# EAGLE design RPI-CM4-Breakout (EAGLE 9.6.2)
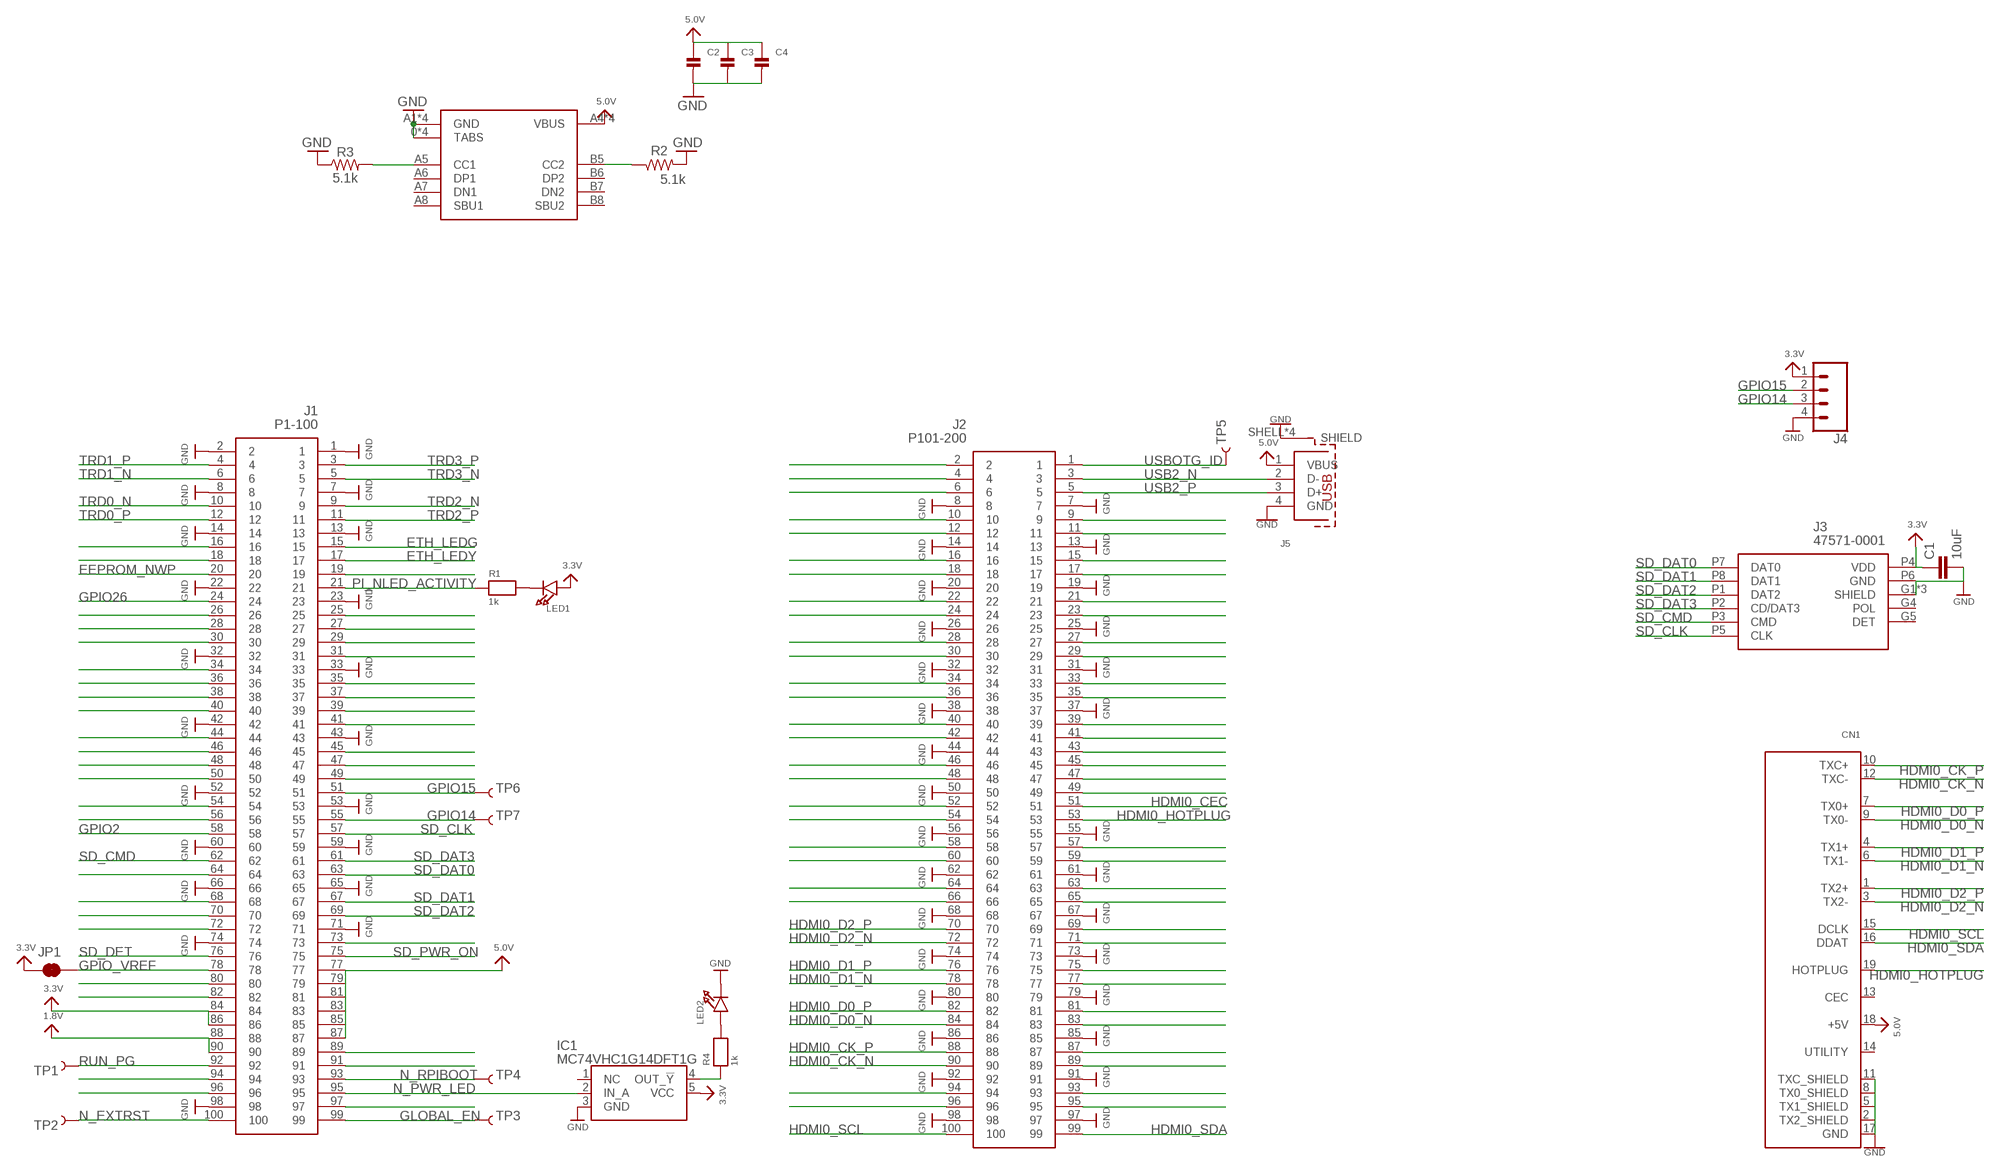
[diagram p0: schematic, sheet 1]

## Parts
C1  10uF  10UF-0603-6.3V-20%  [0603]
C2  CAP_CERAMIC0402  [0402]
C3  CAP_CERAMIC0402  [0402]
C4  CAP_CERAMIC0402  [0402]
CN1  HDMI_MOLEX_47151-0001  [HDMI_MOLEX_47151-0001]
IC1  MC74VHC1G14DFT1G  [SOT65P210X110-5N]
J1  P1-100  DF40C-100DS-0.4V_51_  [DF40C100DS04V51]
J2  P101-200  DF40C-100DS-0.4V_51_  [DF40C100DS04V51]
J3  47571-0001  [47571-0001]
J4  CONN_04SMD_RA_FEMALE  [1X04_SMD_RA_FEMALE]
J5  629104190121  [629104190121]
JP1  JUMPER-SMT_2_NC_TRACE_NO-SILK  [SMT-JUMPER_2_NC_TRACE_NO-SILK]
LED1  LED0603  [CHIPLED_0603]
LED2  LED0603  [CHIPLED_0603]
R1  1k  RESISTOR_0402MP  [_0402MP]
R2  5.1k  RESISTOR0603  [0603]
R3  5.1k  RESISTOR0603  [0603]
R4  1k  RESISTOR_0402MP  [_0402MP]
TP1  TEST-POINT3X5  [PAD.03X.05]
TP2  TEST-POINT3X5  [PAD.03X.05]
TP3  TEST-POINT3X5  [PAD.03X.05]
TP4  TEST-POINT3X5  [PAD.03X.05]
TP5  TEST-POINT3X5  [PAD.03X.05]
TP6  TEST-POINT3X5  [PAD.03X.05]
TP7  TEST-POINT3X5  [PAD.03X.05]
U$59  TYPE-C-31-M-12  [USB-TYPE-C_16PIN-MALE-TYPE-C-31-M-12]

## Nets
1.8V: J1.88 J1.90
3.3V: C1.1 IC1.5(VCC) J1.84 J1.86 J3.P4(VDD) J4.1 JP1.1 LED1.A
5.0V: C2.1 C3.1 C4.1 CN1.18(+5V) J1.77 J1.79 J1.81 J1.83 J1.85 J1.87 J5.1(VBUS) U$59.A4(VBUS) U$59.A9(VBUS) U$59.B4(VBUS) U$59.B9(VBUS)
A0/CC2: R3.2 U$59.A5(CC1)
A3/CC1: R2.1 U$59.B5(CC2)
EEPROM_NWP: J1.20
ETH_LEDG: J1.15
ETH_LEDY: J1.17
GLOBAL_EN: J1.99 TP3.P$1
GND: C1.2 C2.2 C3.2 C4.2 CN1.2(TX2_SHIELD) CN1.5(TX1_SHIELD) CN1.8(TX0_SHIELD) CN1.11(TXC_SHIELD) CN1.17(GND) IC1.3(GND) J1.1 J1.2 J1.7 J1.8 J1.13 J1.14 J1.22 J1.23 J1.32 J1.33 J1.42 J1.43 J1.52 J1.53 J1.59 J1.60 J1.65 J1.66 J1.71 J1.74 J1.98 J2.7 J2.8 J2.13 J2.14 J2.19 J2.20 J2.25 J2.26 J2.31 J2.32 J2.37 J2.38 J2.44 J2.50 J2.55 J2.56 J2.61 J2.62 J2.67 J2.68 J2.73 J2.74 J2.79 J2.80 J2.85 J2.86 J2.91 J2.92 J2.97 J2.98 J3.G1(SHIELD) J3.G2(SHIELD) J3.G3(SHIELD) J3.P6(GND) J4.4 J5.4(GND) J5.SHELL1(SHIELD) J5.SHELL2(SHIELD) J5.SHELL3(SHIELD) J5.SHELL(SHIELD) LED2.C R2.2 R3.1 U$59.0(TABS) U$59.0-1(TABS) U$59.0-2(TABS) U$59.0-3(TABS) U$59.A1(GND) U$59.A12(GND) U$59.B1(GND) U$59.B12(GND)
GPIO2: J1.58
GPIO14: J1.55 J4.3 TP7.P$1
GPIO15: J1.51 J4.2 TP6.P$1
GPIO26: J1.24
GPIO_VREF: J1.78 JP1.2
HDMI0_CEC: J2.51
HDMI0_CK_N: CN1.12(TXC-) J2.90
HDMI0_CK_P: CN1.10(TXC+) J2.88
HDMI0_D0_N: CN1.9(TX0-) J2.84
HDMI0_D0_P: CN1.7(TX0+) J2.82
HDMI0_D1_N: CN1.6(TX1-) J2.78
HDMI0_D1_P: CN1.4(TX1+) J2.76
HDMI0_D2_N: CN1.3(TX2-) J2.72
HDMI0_D2_P: CN1.1(TX2+) J2.70
HDMI0_HOTPLUG: CN1.19(HOTPLUG) J2.53
HDMI0_SCL: CN1.15(DCLK) J2.100
HDMI0_SDA: CN1.16(DDAT) J2.99
N$1: LED1.C R1.2
N$3: J2.2
N$4: IC1.4(OUT_!Y) R4.1
N$5: J2.4
N$6: LED2.A R4.2
N$7: J2.6
N$10: J2.9
N$11: J2.10
N$12: J2.11
N$13: J2.12
N$16: J1.16
N$17: J2.15
N$18: J1.18
N$19: J1.19
N$20: J2.16
N$21: J2.17
N$22: J2.18
N$25: J1.25
N$26: J1.26
N$27: J1.27
N$28: J1.28
N$29: J1.29
N$30: J1.30
N$31: J1.31
N$32: J2.21
N$33: J2.22
N$34: J1.34
N$35: J1.35
N$36: J1.36
N$37: J1.37
N$38: J1.38
N$39: J1.39
N$40: J1.40
N$41: J1.41
N$42: J2.23
N$43: J2.24
N$44: J1.44
N$45: J1.45
N$46: J1.46
N$47: J1.47
N$48: J1.48
N$49: J1.49
N$50: J1.50
N$54: J1.54
N$56: J1.56
N$57: J2.27
N$58: J2.28
N$59: J2.29
N$60: J2.30
N$63: J2.33
N$64: J1.64
N$65: J2.34
N$66: J2.35
N$67: J2.36
N$68: J1.68
N$70: J1.70
N$72: J1.72
N$73: J1.73
N$74: J2.39
N$75: J2.40
N$76: J2.41
N$77: J2.42
N$78: J2.43
N$80: J1.80
N$81: J2.45
N$82: J1.82
N$83: J2.46
N$84: J2.47
N$85: J2.48
N$86: J2.49
N$89: J1.89
N$90: J2.52
N$91: J1.91
N$93: J2.54
N$94: J1.94
N$96: J1.96
N$97: J1.97
N$99: J2.57
N$100: J2.58
N$101: J2.59
N$102: J2.60
N$105: J2.63
N$106: J2.64
N$107: J2.65
N$108: J2.66
N$111: J2.69
N$113: J2.71
N$117: J2.75
N$119: J2.77
N$123: J2.81
N$125: J2.83
N$129: J2.87
N$131: J2.89
N$135: J2.93
N$136: J2.94
N$137: J2.95
N$138: J2.96
N_EXTRST: J1.100 TP2.P$1
N_PWR_LED: IC1.2(IN_A) J1.95
N_RPIBOOT: J1.93 TP4.P$1
PI_NLED_ACTIVITY: J1.21 R1.1
RUN_PG: J1.92 TP1.P$1
SD_CLK: J1.57 J3.P5(CLK)
SD_CMD: J1.62 J3.P3(CMD)
SD_DAT0: J1.63 J3.P7(DAT0)
SD_DAT1: J1.67 J3.P8(DAT1)
SD_DAT2: J1.69 J3.P1(DAT2)
SD_DAT3: J1.61 J3.P2(CD/DAT3)
SD_DET: J1.76
SD_PWR_ON: J1.75
TRD0_N: J1.10
TRD0_P: J1.12
TRD1_N: J1.6
TRD1_P: J1.4
TRD2_N: J1.9
TRD2_P: J1.11
TRD3_N: J1.5
TRD3_P: J1.3
USB2_N: J2.3 J5.2(D-)
USB2_P: J2.5 J5.3(D+)
USBOTG_ID: J2.1 TP5.P$1
Unconnected: CN1.13(CEC) CN1.14(UTILITY) IC1.1(NC) J3.G4(POL) J3.G5(DET) U$59.A6(DP1) U$59.A7(DN1) U$59.A8(SBU1) U$59.B6(DP2) U$59.B7(DN2) U$59.B8(SBU2)

## Power pins joined to a net without a drawn wire
GND: CN1.P$1(GND) CN1.P$2(GND) CN1.P$3(GND) CN1.P$4(GND)

## Library data of the parts
C1 = SparkFun-Capacitors:10UF: 10.0µF ceramic capacitors A capacitor is a passive two-terminal electrical component used to store electrical energy temporarily in an electric field.; PROD_ID: CAP-11015
C2-C4 = microbuilder:CAP_CERAMIC: Ceramic Capacitors 0402 - 0402 Surface Mount Capacitors 16pF 50V 5% [Digikey: 445-4899-2-ND] 18pF 50V 5% [Digikey: 490-1281-2-ND] 22pF 50V 5% [Digikey: 490-1283-2-ND] 68pF 50V 5% [Digikey: 490-1289-2-ND] 0.1uF 10V 10% [Digikey: 490-1318-2-ND] 1.0uF 6.3V 10% [Digikey: 490-1320-2-ND] 0603 - 0603 Surface Mount Capacitors 16 pF 50V 5% [Digikey: 445-5051-2-ND] 22 pF 50V [Digikey: PCC220ACVTR-ND] 33 pF 50V 5% [Digikey: 490-1415-1-ND] 56pF 50V 5% [Digikey: 490-1421-1-ND] 220pF 50V 5% [Digikey: 445-1285-1-ND] 680 pF 50V 2200 pF 50V 5% C0G [Digikey: 445-1297-1-ND] 5600 pF 100V 5% X7R [Digikey: 478-3711-1-ND] 0.1 µF 25V 10% [Digikey: PCC2277TR-ND] 0.22 µF 16V 10% X7R [Digikey: 445-1318-1-ND] 1.0 µF 25V 10% [Digikey: 445-5146-2-ND] 0603 - RF Specific 3pF 250V +/-0.1pF RF [Digikey: 712-1347-1-ND] 18 pF 250V 5% [Digikey: 478-3505-1-ND or 712-1322-1-ND] 56 pF 250V 5% C0G RF [Digikey: 490-4867-1-ND] 68 pF 250V RF [Digikey: 490-4868-1-ND] 0805 - 0805 Surface Mount Capacitors 220 pF 250V 2% RF Ceramic Capacitor [Digikey: 712-1398-1-ND] 1000 pF 50V 2% NP0 Ceramic Capacitor [Digikey: 478-3760-1-ND] 0.1 µF 25V 10% Ceramic Capacitor [Digikey: PCC1828TR-ND] 1.0 µF 16V 10% Ceramic Capacitor[Digikey: 490-1691-2-ND] 10.0 µF 10V 10% Ceramic Capacitor[Digikey: 709-1228-1-ND] 10.0 uF 16V 10% Ceramic Capacitor [Digikey: 478-5165-2-ND] 47 uF 6.3V 20% Ceramic Capacitor [Digikey: 587-1779-1-ND or 399-5506-1-ND] 1206 - 1206 Surface Mount Capacitors 47uF 10V 20% Ceramic Capacitor [Digikey: 490-5528-1-ND or 399-5508-1-ND or 445-6010-1-ND] 100uF 6.3V -20%, +80% Y5V Ceramic Capacitor (Digikey: 490-4512-1-ND, Mouser: 81-GRM31CF50J107ZE1L)
CN1 = microbuilder:HDMI_MOLEX_47151-0001
IC1 = SamacSys_Parts:MC74VHC1G14DFT1G: Source: Datasheet <http://www.onsemi.com/pub/Collateral/MC74VHC1G14-D.PDF>; HEIGHT: 1.1mm; MANUFACTURER_NAME: ON Semiconductor; MANUFACTURER_PART_NUMBER: MC74VHC1G14DFT1G; MOUSER_PART_NUMBER: 863-MC74VHC1G14DFT1G; MOUSER_PRICE-STOCK: https://www.mouser.co.uk/ProductDetail/ON-Semiconductor/MC74VHC1G14DFT1G?qs=YOLdObVcOZkl2BbCxsVnXA%3D%3D
J1 J2 = SamacSys_Parts:DF40C-100DS-0.4V_51_: HIROSE(HRS) - DF40C-100DS-0.4V(51) - CONNECTOR, STACKING, RCPT, 100POS, 2ROW Source: Datasheet <https://www.hirose.com/product/en/download_file/key_name/DF40C-100DS-0.4V(51)/category/Drawing (2D)/doc_file_id/46856/?file_category_id=6&item_id=06844033451&is_series=>; DESCRIPTION: HIROSE(HRS) - DF40C-100DS-0.4V(51) - CONNECTOR, STACKING, RCPT, 100POS, 2ROW; HEIGHT: 1.65mm; MANUFACTURER_NAME: Hirose; MANUFACTURER_PART_NUMBER: DF40C-100DS-0.4V(51); MOUSER_PART_NUMBER: 798-DF40C100DS0.4V51; MOUSER_PRICE-STOCK: https://www.mouser.co.uk/ProductDetail/Hirose-Connector/DF40C-100DS-04V51?qs=eDUdFcBPps2MEwbnuPvZzQ%3D%3D
J3 = SamacSys_Parts:47571-0001: Memory Card Connectors ASSY FOR TFR HEADER HEADER W/DETECT PIN Source: Datasheet <https://componentsearchengine.com/Datasheets/1/47571-0001.pdf>; DESCRIPTION: Memory Card Connectors ASSY FOR TFR HEADER HEADER W/DETECT PIN; HEIGHT: mm; MANUFACTURER_NAME: Molex; MANUFACTURER_PART_NUMBER: 47571-0001; MOUSER_PART_NUMBER: 538-47571-0001; MOUSER_PRICE-STOCK: https://www.mouser.com/Search/Refine.aspx?Keyword=538-47571-0001
J4 = SparkFun-Connectors:CONN_04: Multi connection point. Often used as Generic Header-pin footprint for 0.1 inch spaced/style header connections On any of the 0.1 inch spaced packages, you can populate with these: Break Away Headers - Straight <https://www.sparkfun.com/products/116> (PRT-00116) Break Away Male Headers - Right Angle <https://www.sparkfun.com/products/553> (PRT-00553) Female Headers <https://www.sparkfun.com/products/115> (PRT-00115) Break Away Headers - Machine Pin <https://www.sparkfun.com/products/117> (PRT-00117) Break Away Female Headers - Swiss Machine Pin <https://www.sparkfun.com/products/743> (PRT-00743) For SCREWTERMINALS and SPRING TERMINALS visit here: Screw Terimnals on SparkFun.com <https://www.sparkfun.com/search/results?term=Screw+Terminals> (5mm/3.5mm/2.54mm spacing) This device is also useful as a general connection point to wire up your design to another part of your project. Our various solder wires solder well into these plated through hole pads. Hook-Up Wire - Assortment (Stranded, 22 AWG) <https://www.sparkfun.com/products/11375> (PRT-11375) Hook-Up Wire - Assortment (Solid Core, 22 AWG) <https://www.sparkfun.com/products/11367> (PRT-11367) View the entire wire category on our website here <https://www.sparkfun.com/categories/141> Special notes: Molex polarized connector foot print use with SKU : PRT-08231 with associated crimp pins and housings. 1MM SMD Version SKU: PRT-10208; PROD_ID: CONN-12382
J5 = EAGLE-INPUT_OUTPUT_CONNECTORS-rev17a:629104190121: USB 2.0 Type A Horizontal SMT Short Type WR-COM_629104190121 <http://katalog.we-online.de/media/images/v2/Family_WR-COM_629104190121.jpg> Details see: http://katalog.we-online.de/en/em/COM_2_0_SMT_TYPE_A_HORIZONTAL_SHORT_TYPE/629104190121 Created bY Yingchun,Shan 2016 (C) Würth Elektronik
JP1 = SparkFun-Jumpers:JUMPER-SMT_2_NC_TRACE: Normally closed trace jumper This jumper has a trace between two pads so it's normally closed (NC). Use a razor knife to open the connection. For best results follow the IPC guidelines for cutting traces: Cutout at least 0.063 mm (0.005 in). Remove all loose material to clean up the cut area. Seal the cut with an approved epoxy. Reapply solder to reclose the connection.
LED1 LED2 = microbuilder:LED: LED 0603 - 0603 Surface Mount Package 2mA: Green LED - Low Power (3.9mcd, 2ma, 1.7Vf) - Digikey: 475-2709-2-ND Orange LED - Low Power (9.8mcd, 2ma, 1.8Vf) - Digikey: 475-1194-2-ND Red LED - Low Power (5mcd, 2ma, 1.8Vf) - Digikey: 475-1195-2-ND Yellow LED - Low Power (7mcd, 2ma, 1.8Vf) - Digikey: 475-1196-2-ND 5mA: Blue LED - Low Power (17mcd, 5ma, 2.9Vf) - Digikey: LNJ937W8CRACT-ND 0805 - 0805 Surface Mount Package 2mA: Red LED (8.8mcd, 2mA, 1.8Vf, Clear) - Low Power [Digikey: 475-2510-1-ND] Green LED (5mcd, 2mA, 1.8Vf, Clear) - Low Power [Digikey: 475-2730-1-ND] Yellow LED (11.3mcd, 2mA, 1.8Vf, Clear) - Low Power [Digikey: 475-2555-1-ND] 20mA: Red LED (104mcd, 20mA, Diffused) - LS R976 [Digikey: 475-1278-6-ND] Red LED (12mcd, 20mA, 2.0Vf, Clear) - APT2012EC [Digikey: 754-1128-1-ND] Green LED (15mcd, 20mA, 2.2Vf, Clear) - APT2012GC [Digikey: 754-1131-1-ND] Orange LED (160mcd, 20mA, 2.1Vf, Clear) - APT2012SECK [Digikey: 754-1130-1-ND] 1206 - 1206 Surface Mount Package Green LED (26mcd, 20mA, Diffused) - LG N971 [Digikey: 475-1407-6-ND] Red LED (15mcd, 20mA, Diffused) - LH N974 [Digikey: 475-1416-6-ND]
R1 R4 = microbuilder:RESISTOR: Resistors 0402 - 0402 Surface Mount Package 22 Ohm 1% 1/16W [Digikey: 311-22.0LRTR-ND] 33 Ohm 5% 1/16W 1.0K 5% 1/16W 1.5K 5% 1/16W 2.0K 1% 1/16W 10.0K 1% 1/16W [Digikey: 311-10.0KLRTR-ND] 10.0K 5% 1/16W [Digikey: RMCF0402JT10K0TR-ND] 12.1K 1% 1/16W [Digikey: 311-22.0LRTR-ND] 100.0K 5% 1/16W 0603 - 0603 Surface Mount Package 0 Ohm 1/10 Watt 1% Resistor 15 Ohm 1/10 Watt 1% Resistor 33 Ohm 1/10 Watt 1% Resistor 49.9 Ohm 1/10 Watt 1% Resistor 100 Ohm 1/10 Watt 1% Resistor 150 Ohm 1/10 Watt 1% Resistor 240 Ohm 1/10 Watt 1% Resistor 390 Ohm 1/10 Watt 1% Resistor 560 Ohm 1/10 Watt 1% Resistor 680 Ohm 1/10 Watt 1% Resistor 750 Ohm 1/10 Watt 1% Resistor 1.0K Ohm 1/10 Watt 1% Resistor 1.5K Ohm 1/10 Watt 1% Resistor 2.0K Ohm 1/10 Watt 1% Resistor 2.2K Ohm 1/10 Watt 1% Resistor 3.3K Ohm 1/10 Watt 1% Resistor 4.7K Ohm 1/10 Watt 1% Resistor 10.0K Ohm 1/10 Watt 1% Resistor 12.0K Ohm 1/10 Watt 1% Resistor 12.1K Ohm 1/10 Watt 1% Resistor 20.0K Ohm 1/10 Watt 1% Resistor 33.0K Ohm 1/10 Watt 1% Resistor 100.0K Ohm 1/10 Watt 1% Resistor 0805 - 0805 Surface Mount Package 0 Ohm 1/8 Watt 1% Resistor 33 Ohm 1/8 Watt 1% Resistor 100 Ohm 1/8 Watt 1% Resistor 150 Ohm 1/8 Watt 1% Resistor 200 Ohm 1/8 Watt 1% Resistor 240 Ohm 1/8 Watt 1% Resistor 330 Ohm 1/8 Watt 1% Resistor 390 Ohm 1/8 Watt 1% Resistor 470 Ohm 1/8 Watt 1% Resistor 1.0K Ohm 1/8 Watt 1% Resistor 1.5K Ohm 1/8 Watt 1% Resistor 2.0K Ohm 1/8 Watt 1% Resistor 4.7K Ohm 1/8 Watt 1% Resistor 5.1K Ohm 1/8 Watt 1% Resistor 5.6K Ohm 1/8 Watt 1% Resistor 10.0K Ohm 1/8 Watt 1% Resistor 22.0K Ohm 1/8 Watt 1% Resistor 33.0K Ohm 1/8 Watt 1% Resistor 100K Ohm 1/8 Watt 1% Resistor 1206 - 1206 Surface Mount Package 2012 - 2010 Surface Mount Package 0.11 Ohm 1/2 Watt 1% Resistor - Digikey: RHM.11UCT-ND
R2 R3 = SparkFun-Resistors:RESISTOR: Generic Resistor Package
TP1-TP7 = SparkFun-Connectors:TEST-POINT: SparkFun Test Points Bare copper test points for troubleshooting or In-Circuit-Testing. These are used by our Production team for verifying production board runs using pogo-pins on test beds. SparkFun Products: SparkFun LSM9DS1 Breakout <https://www.sparkfun.com/products/13284> SparkFun PSOC <https://www.sparkfun.com/products/13714> SparkFun Load Cell Amplifier <https://www.sparkfun.com/products/13879>
U$59 = Custom-Parts:TYPE-C-31-M-12

## Board
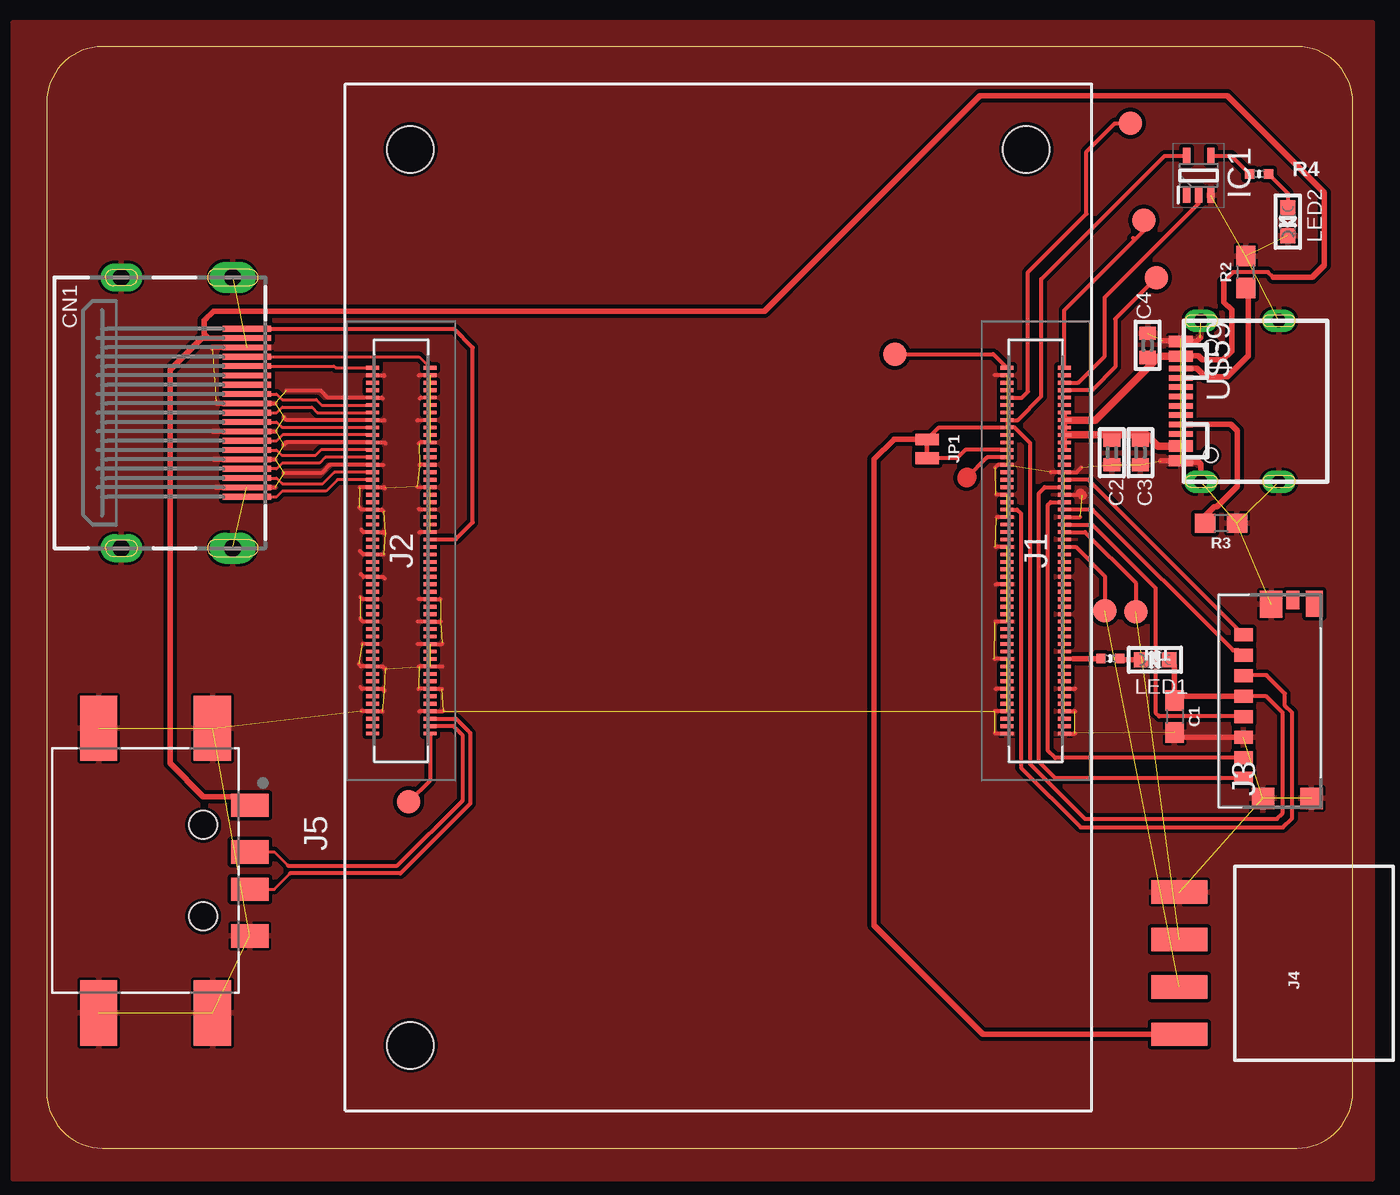
[diagram p1: board, top side]

Size 70 x 59 mm. Coordinates in mm from the lower left corner, seen from the top.
Outline: 67,59 3,59 arc90 0,56 0,3 arc90 3,0 67,0 arc90 70,3 70,56 arc90 67,59
Copper layers (1*16): Top 0.035mm / dielectric 1.5mm / Bottom 0.035mm
Design rules "OthermillDRC_30_deg_v2": minimum track width 6mil, minimum drill 0.8mm, track to track 6mil, track to pad 6mil, pad to pad 6mil, via to via 6mil, smd to smd 0mil, copper to edge 0mil, drill to drill 6mil, minimum pad ring 10mil, minimum via ring 10mil, stop-mask expansion 1mil, vias tented up to drill 30mil, thermal gap 6mil
Holes 2.5 mm at 19.5,53.5 52.5,53.5 19.5,5.5

### Footprints (pad centres in the part's own frame; a part is rotated, then mirrored left to right if it is on the bottom)
0603 = smd 1.1 x 1: 1 -0.85,0; 2 0.85,0
0402 = smd 0.7 x 0.9: 1 -0.65,0; 2 0.65,0
HDMI_MOLEX_47151-0001 = smd 0.3 x 2.6: 1 4.5,0; 2 4,0; 3 3.5,0; 4 3,0; 5 2.5,0; 6 2,0; 7 1.5,0; 8 1,0; 9 0.5,0; 10 0,0; 11 -0.5,0; 12 -1,0; 13 -1.5,0; 14 -2,0; 15 -2.5,0; 16 -3,0; 17 -3.5,0; 18 -4,0; 19 -4.5,0 | drill 0.9 pad 1.65 long: P$1 -7.25,-0.76; P$2 7.25,-0.76 | drill 0.9 pad 1.5 long: P$3 7.25,-6.72; P$4 -7.25,-6.72
SOT65P210X110-5N = smd 0.85 x 0.4: 1 -1.05,0.65; 2 -1.05,0; 3 -1.05,-0.65; 4 1.05,-0.65; 5 1.05,0.65
DF40C100DS04V51 = smd 0.2 x 0.7: 1 -9.8,-1.54; 2 -9.8,1.54; 3 -9.4,-1.54; 4 -9.4,1.54; 5 -9,-1.54; 6 -9,1.54; 7 -8.6,-1.54; 8 -8.6,1.54; 9 -8.2,-1.54; 10 -8.2,1.54; 11 -7.8,-1.54; 12 -7.8,1.54; 13 -7.4,-1.54; 14 -7.4,1.54; 15 -7,-1.54; 16 -7,1.54; 17 -6.6,-1.54; 18 -6.6,1.54; 19 -6.2,-1.54; 20 -6.2,1.54; 21 -5.8,-1.54; 22 -5.8,1.54; 23 -5.4,-1.54; 24 -5.4,1.54; 25 -5,-1.54; 26 -5,1.54; 27 -4.6,-1.54; 28 -4.6,1.54; 29 -4.2,-1.54; 30 -4.2,1.54; 31 -3.8,-1.54; 32 -3.8,1.54; 33 -3.4,-1.54; 34 -3.4,1.54; 35 -3,-1.54; 36 -3,1.54; 37 -2.6,-1.54; 38 -2.6,1.54; 39 -2.2,-1.54; 40 -2.2,1.54; 41 -1.8,-1.54; 42 -1.8,1.54; 43 -1.4,-1.54; 44 -1.4,1.54; 45 -1,-1.54; 46 -1,1.54; 47 -0.6,-1.54; 48 -0.6,1.54; 49 -0.2,-1.54; 50 -0.2,1.54; 51 0.2,-1.54; 52 0.2,1.54; 53 0.6,-1.54; 54 0.6,1.54; 55 1,-1.54; 56 1,1.54; 57 1.4,-1.54; 58 1.4,1.54; 59 1.8,-1.54; 60 1.8,1.54; 61 2.2,-1.54; 62 2.2,1.54; 63 2.6,-1.54; 64 2.6,1.54; 65 3,-1.54; 66 3,1.54; 67 3.4,-1.54; 68 3.4,1.54; 69 3.8,-1.54; 70 3.8,1.54; 71 4.2,-1.54; 72 4.2,1.54; 73 4.6,-1.54; 74 4.6,1.54; 75 5,-1.54; 76 5,1.54; 77 5.4,-1.54; 78 5.4,1.54; 79 5.8,-1.54; 80 5.8,1.54; 81 6.2,-1.54; 82 6.2,1.54; 83 6.6,-1.54; 84 6.6,1.54; 85 7,-1.54; 86 7,1.54; 87 7.4,-1.54; 88 7.4,1.54; 89 7.8,-1.54; 90 7.8,1.54; 91 8.2,-1.54; 92 8.2,1.54; 93 8.6,-1.54; 94 8.6,1.54; 95 9,-1.54; 96 9,1.54; 97 9.4,-1.54; 98 9.4,1.54; 99 9.8,-1.54; 100 9.8,1.54
47571-0001 = smd 1.15 x 1.2: G1 -5.225,0.365; G2 -5.225,-2.225 | smd 1.45 x 1.2: G3 5.175,-0.075 | smd 1 x 0.7: G4 5.4,-1.225 | smd 1.4 x 0.9: G5 5.2,-2.375 | smd 0.7 x 1: P1 3.55,1.415; P2 2.45,1.415; P3 1.35,1.415; P4 0.25,1.415; P5 -0.85,1.415; P6 -1.95,1.415; P7 -3.05,1.415; P8 -4.15,1.415
1X04_SMD_RA_FEMALE = smd 1.25 x 3: 1 -3.81,7.225; 2 -1.27,7.225; 3 1.27,7.225; 4 3.81,7.225
629104190121 = smd 1.25 x 2: 1 -3.5,2; 2 -1,2; 3 1,2; 4 3.5,2 | smd 3.5 x 2: SHELL -7.625,0; SHELL1 7.625,0; SHELL2 -7.625,-6.1; SHELL3 7.625,-6.1 | hole 1.5: -2.45,-0.5; 2.45,-0.5
SMT-JUMPER_2_NC_TRACE_NO-SILK = smd 0.635 x 1.27: 1 -0.508,0; 2 0.508,0
CHIPLED_0603 = smd 0.8 x 0.8: A 0,-0.75; C 0,0.75
_0402MP = smd 0.5 x 0.5: 1 -0.508,0; 2 0.508,0
PAD.03X.05 = smd 1.27 x 1.27: P$1 0,0
USB-TYPE-C_16PIN-MALE-TYPE-C-31-M-12 = drill 0.7 pad 1.2 long: 0 -4.32,1.556; 0-1 4.32,1.556; 0-2 4.32,-2.624; 0-3 -4.32,-2.624 | smd 0.3 x 1.3: A1 -3.35,2.623; A4 -2.55,2.623; A5 -1.25,2.623; A6 -0.25,2.623; A7 0.25,2.623; A8 1.25,2.624; A9 2.55,2.623; A12 3.35,2.623; B1 3.05,2.623; B4 2.25,2.623; B5 1.75,2.623; B6 0.75,2.623; B7 -0.75,2.623; B8 -1.75,2.624; B9 -2.25,2.623; B12 -3.05,2.623 | hole 0.75: 2.89,1.026; -2.89,1.026

### Placement (x,y rotation side)
C1  60.44,23.12 270 top
C2  57.09,37.25 270 top
C3  58.62,37.25 270 top
C4  59,43 90 top
CN1  10.72,39.39 270 top
IC1  61.74,52.1 90 top
J1  53,32 90 top
J2  19,32 90 top
J3  65.55,23.95 90 top
J4  67.92,9.9 90 top
J5  8.89,14.86 270 top
JP1  47.18,37.45 270 top
LED1  59.4,26.16 90 top
LED2  66.51,49.62 180 top
R1  57,26.23 0 top
R2  64.26,46.93 90 top
R3  62.94,33.47 180 top
R4  64.97,52.18 0 top
TP1  58.08,54.89 0 top
TP2  45.47,42.53 0 top
TP3  58.79,49.69 0 top
TP4  59.47,46.62 0 top
TP5  19.4,18.54 0 top
TP6  56.71,28.79 0 top
TP7  58.36,28.73 0 top
U$59  63.41,40.01 90 top

### Tracks (layer width: path | path; a pad name or v marks a point on that pad's centre or on a via)
1.8V  (1 unrouted)
3.3V
  Top 0.152: J1.86 J1.84
  Top 0.203: JP1.1 47.82,38.6 J1.84 51.86,38.6 52.7,37.77 52.7,20.58 55.64,17.64 65.93,17.64 66.23,17.94 66.23,23.33 65.36,24.2 J3.P4 | J1.86 52.04,39 53.31,40.27 53.31,46.54 59.92,53.15 IC1.5
  Top 0.305: J3.P4 60.68,24.2 C1.1 60.44,25.86 LED1.A | JP1.1 45.41,37.96 45.41,37.95 44.34,36.89 44.34,34.45 44.34,11.92 50.17,6.09 J4.1
5.0V  (1 unrouted)
  Top 0.152: J1.87 54.54,39.28 J1.85 J1.83 J1.81 54.54,38.01 J1.79 54.54,37.5 J1.77
  Top 0.203: 65.73,46.64 65.45,46.92 63.59,46.92 63.08,46.41 | U$59.B4 60.81,42.28 60.81,42.53 U$59.A9 | C4.1 59.17,42.35 59.36,42.16 | C2.1 57.09,38.12 57.17,38.2 | C3.1 58.62,38.13 58.69,38.2 | J1.77 54.54,37.5 | 54.54,38.01 54.54,39.28 J1.87
  Top 0.305: 60.6,37.6 60.63,37.6 U$59.B9 | U$59.A9 60.65,42.43 60.19,42.43 | 8.45,44.33 8.45,43.59 8.66,43.39 CN1.18 8.32,43.39 6.62,41.69 6.62,20.61 8.4,18.83 10.42,18.83 J5.1 | 8.45,44.33 8.55,44.43 | 8.45,44.33 8.96,44.84 38.47,44.84 50,56.37 63.26,56.37 68.47,51.16 68.47,47.28 67.83,46.64 65.73,46.64 | U$59.B4 60.96,42.44 61.73,42.44 61.94,42.22 63.03,42.22 63.5,42.69 63.5,44.9 63.08,45.32 63.08,46.41 | J1.79 54.54,38.01 | 54.54,38.01 54.54,39.28 | 54.54,38.01 54.54,37.5
  Top 0.406: J1.81 57.17,38.2 58.69,38.2 58.95,38.2 59.56,37.6 60.6,37.6 | J1.85 56.2,39 59.36,42.16 59.63,42.43 60.19,42.43
A0/CC2
  Top 0.203: 62.7,34.35 62.58,34.35 | 62.09,33.86 R3.2
  Top 0.305: U$59.A5 63.45,38.76 63.8,38.41 63.8,35.44 62.7,34.35 | 62.58,34.35 62.09,33.86
A3/CC1
  Top 0.203: R2.1 64.39,45.95 | U$59.B5
  Top 0.305: 64.39,45.95 64.39,42.44 63.26,41.31 62.09,41.31 61.64,41.77 U$59.B5
GLOBAL_EN
  Top 0.203: J1.99 54.54,44.88 58.4,48.74 | TP3.P$1 58.79,49.13 58.4,48.74 | 58.22,48.74 58.4,48.74
GND  (83 unrouted)
  Top 0.152: 53.84,36.2 53.81,36.23 | 50.88,35 50.87,34.98 | 50.93,33.8 50.89,33.76 | 50.85,32.2 50.84,32.19 | 50.86,30.2 50.82,30.16 | 50.87,28.2 50.82,28.15
  Top 0.2: J2.91 20.04,40.2 | J2.85 19.88,39 | J2.67 19.87,35.4 19.85,35.41
  Top 0.203: 55.44,36.46 55.18,36.2 J1.71 53.84,36.2 | J1.66 50.88,35 | J1.60 50.93,33.8 | J1.52 50.85,32.2 | J1.42 50.86,30.2 | J1.32 50.87,28.2 | J1.22 50.8,26.2 50.79,26.2 | J1.74 50.99,36.6 50.84,36.46 | J1.98 50.8,41.4 50.79,41.41 | J1.14 50.87,24.6 50.87,24.59 | J1.8 50.82,23.4 | J1.2 50.85,22.2 50.82,22.23 | 21.1,29.4 21.09,29.4 J2.37 19.98,29.4 19.96,29.42 | 21.12,28.2 J2.31 19.88,28.2 | J2.26 16.91,27.01 | 18.13,30.51 18.04,30.6 J2.44 16.97,30.6 16.83,30.74 | 18.05,31.78 18.03,31.8 J2.50 16.97,31.8 16.78,31.99 | 18.13,32.93 18.05,33 J2.56 16.99,33 16.86,33.13 | 18.05,34.12 17.97,34.2 J2.62 16.88,34.2 16.76,34.32 | 18.13,35.34 18.07,35.4 J2.68 16.79,35.4 16.78,35.39 | J2.61 19.98,34.2 19.96,34.22 | J2.55 20,33 19.98,32.98 | 18.05,36.58 18.04,36.6 J2.74 15.17,36.6 14.72,36.15 12.72,36.15 | 18.15,37.75 18.11,37.8 J2.80 12.84,37.8 12.69,37.65 | 18.1,38.97 18.07,39 J2.86 12.87,39 12.72,39.15 | 18.03,40.14 17.96,40.2 J2.92 15.07,40.2 14.7,40.57 12.84,40.57 | J2.98 18.06,41.4 18.1,41.36 | CN1.5 12.23,36.89 | CN1.8 12.26,38.39 | 12.26,38.39 | CN1.11 12.23,39.89 | CN1.2 12.23,35.39 | J1.1 55.1,22.2 55.11,22.21 | J1.7 55.08,23.4 55.11,23.38 | J1.13 55.09,24.6 55.11,24.62 | J2.97 19.97,41.4 19.96,41.38 | 20.04,40.2 20.01,40.16 | 19.88,39 19.85,38.97 | J2.79 20,37.8 19.96,37.75 | J2.73 20,36.6 19.98,36.58 | 19.96,25.79 19.97,25.8 J2.19 21.19,25.8 21.2,25.79 | 21.18,24.59 21.17,24.6 J2.13 19.93,24.59 | 21.25,23.4 J2.7 20.01,23.4 19.98,23.38 | 18,23.38 17.98,23.4 J2.8 16.91,23.4 16.88,23.43 | 16.81,24.7 16.9,24.6 J2.14 18,24.6 18.1,24.49 | 16.73,25.92 16.85,25.8 J2.20 18.01,25.8 18.15,25.66 | J2.32 16.96,28.2 16.81,28.35 | J2.38 16.93,29.4 16.81,29.52
  Top 0.203: 19.91,27.01 19.91,27 J2.25 21.17,27 21.2,27.03 | J1.65 55.3,35 55.39,35.09 | J1.59 55.37,33.8 55.39,33.81
  Top 0.305: C1.2 60.71,22 J3.P6 | CN1.5 8.98,36.89 | CN1.2 9.09,35.39 | CN1.8 8.93,38.39 | CN1.11 9.13,39.89 9.09,39.94 | CN1.17 8.89,42.89 8.88,42.88 | U$59.B12 60.64,36.81 59.71,36.81 | 59.83,43.24 60.67,43.24 U$59.A12 60.93,43.21 61.61,43.21 61.81,43.42 | U$59.A1 60.86,36.74 61.74,36.74 61.85,36.62 U$59.0
  Top 0.508: 55.39,35.09 55.52,34.96
  pour Top (isolate 0.203): -1.78,60.28 71.04,60.28 71.04,-1.66 -1.78,-1.66
GPIO14  (1 unrouted)
  Top 0.203: J1.55 55.64,33 58.36,30.28 TP7.P$1
GPIO15  (1 unrouted)
  Top 0.203: J1.51 55.15,32.2 56.71,30.64 TP6.P$1
GPIO_VREF
  Top 0.152: 46.82,36.97 46.82,36.94 47.59,36.94 JP1.2
  Top 0.203: J1.78 49.25,37.4 48.79,36.94 47.59,36.94
HDMI0_CK_N
  Top 0.152: J2.90 14.73,39.8 14.44,40.09 12.62,40.09 12.33,40.39 CN1.12
HDMI0_CK_P
  Top 0.152: CN1.10 12.33,39.39 12.62,39.68 14.21,39.68 14.5,39.4 J2.88
HDMI0_D0_N
  Top 0.152: CN1.9 12.33,38.89 12.61,38.6 J2.84
HDMI0_D0_P
  Top 0.152: J2.82 12.64,38.2 12.33,37.89 CN1.7
HDMI0_D1_N
  Top 0.152: J2.78 14.7,37.4 14.39,37.09 12.62,37.09 12.33,37.39 CN1.6
HDMI0_D1_P
  Top 0.152: J2.76 14.94,37 14.62,36.68 12.62,36.68 12.33,36.39 CN1.4
HDMI0_D2_N
  Top 0.152: J2.72 15.41,36.2 14.8,35.59 12.62,35.59 12.33,35.89 CN1.3
HDMI0_D2_P
  Top 0.152: J2.70 15.59,35.8 14.98,35.18 12.62,35.18 12.33,34.89 CN1.1
HDMI0_HOTPLUG
  Top 0.203: CN1.19 21.82,43.89 22.83,42.88 22.83,33.51 21.92,32.6 J2.53
HDMI0_SCL
  Top 0.152: CN1.15 15.39,41.89 15.48,41.8 J2.100
HDMI0_SDA
  Top 0.152: CN1.16 19.95,42.39 J2.99
N$1
  Top 0.305: LED1.C 57.58,26.16 R1.2
N$4
  Top 0.203: IC1.4 63.49,53.15 R4.1
N$6
  Top 0.203: R4.2 66.51,51.14 LED2.A
N_EXTRST
  Top 0.203: TP2.P$1 50.73,42.53 J1.100
N_PWR_LED
  Top 0.203: J1.95 55.28,41 56.71,42.43 56.71,45.58 61.74,50.6 IC1.2
N_RPIBOOT
  Top 0.203: J1.93 56.03,40.6 57.27,41.84 57.27,44.42 TP4.P$1
PI_NLED_ACTIVITY
  Top 0.152: J1.21 54.75,26.2
  Top 0.254: J1.21 55.02,26.2
  Top 0.305: R1.1 56.47,26.2 55.02,26.2
RUN_PG
  Top 0.203: J1.92 52.27,40.2 52.59,40.52 52.59,46.92 55.72,50.05 55.72,53.37 57.24,54.89 TP1.P$1
SD_CLK
  Top 0.152: 64.11,23.12 J3.P5
  Top 0.203: J1.57 56.03,33.4 59.42,30.01 59.42,23.33 59.62,23.12 64.11,23.12
SD_CMD
  Top 0.152: 64.17,25.33 J3.P3
  Top 0.203: 64.17,25.33 65.37,25.33 66.36,24.34 66.36,23.7 66.74,23.32 66.74,17.67 66.25,17.18 55.42,17.18 52.21,20.38 52.21,33.99 52.01,34.2 J1.62
SD_DAT0
  Top 0.203: J3.P7 54.05,20.9 53.66,21.29 53.66,34.45 53.81,34.6 J1.63
SD_DAT1
  Top 0.203: J3.P8 54.06,19.8 53.18,20.68 53.18,35.09 53.49,35.4 J1.67
SD_DAT2
  Top 0.203: J3.P1 55.83,35.8 J1.69
SD_DAT3
  Top 0.152: J3.P2 63.88,26.65
  Top 0.203: 63.88,26.65 63.59,26.65 56.05,34.2 J1.61
SD_DET
  Top 0.203: J1.76 50.4,37 49.33,35.94
  Top 1.016: 49.29,35.9 49.33,35.94
USB2_N
  Top 0.152: J5.2 12.2,15.86 12.93,15.12
  Top 0.203: J2.3 21.8,22.6 22.28,22.12 22.28,18.62 18.79,15.12 12.93,15.12
USB2_P
  Top 0.152: J5.3 12.2,13.86 13.05,14.71
  Top 0.203: J2.5 21.93,23 22.56,22.37 22.7,22.23 22.7,18.45 18.96,14.71 13.05,14.71
USBOTG_ID
  Top 0.203: J2.1 20.54,19.67 TP5.P$1